# Altium project Nixie_clocks_Main_board.PrjPcb
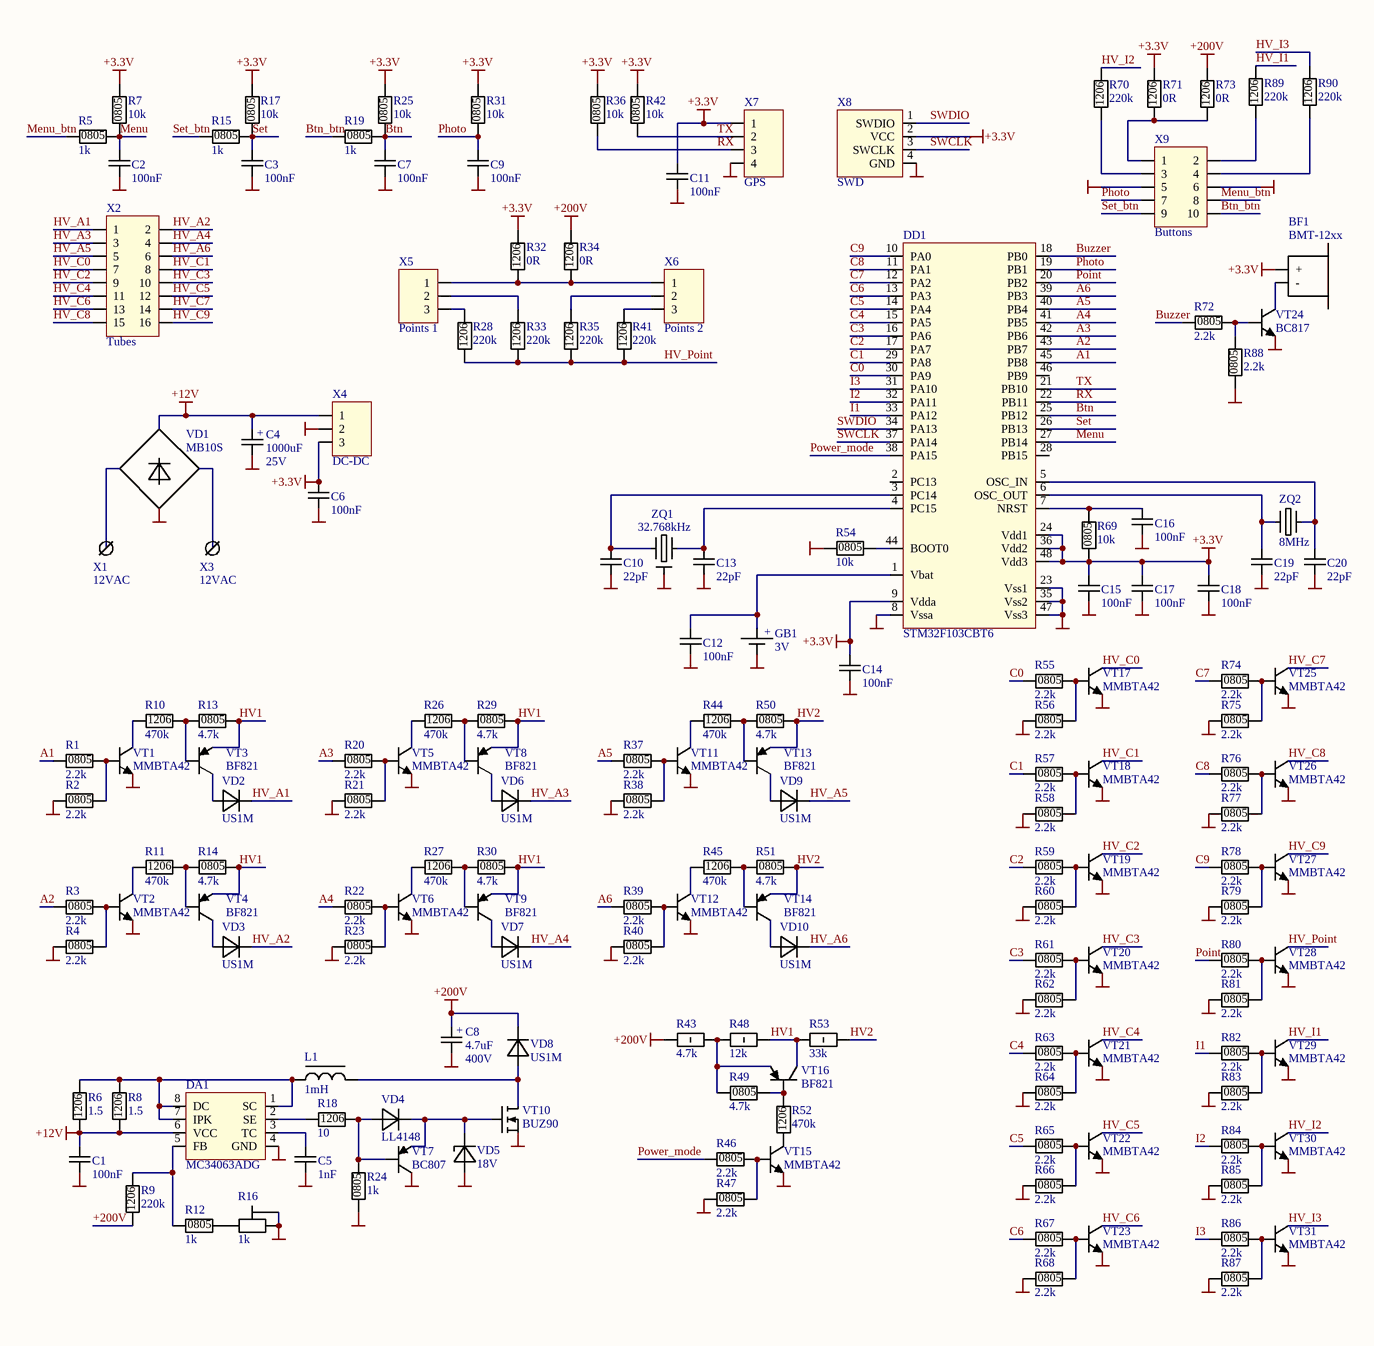
[diagram p0: Nixie_clocks_Main_board.SchDoc]
1 sheet, 167 parts. Net scope: global (net labels, ports and power ports of the same name join across sheets).
Board file: Nixie_clocks_Main_board.PcbDoc

## Sheet Nixie_clocks_Main_board.SchDoc
size A3 portrait

### Parts
BF1  BMT-12xx  [BMT-12xx]
C1  100nF  [C0805]
C2  100nF  [C0805]
C3  100nF  [C0805]
C4  1000uF  Voltage: 25V  [CapEl 10x20x5]
C5  1nF  [C0805]
C6  100nF  [C0805]
C7  100nF  [C0805]
C8  4.7uF  Voltage: 400V  [CapEl 10x20x5]
C9  100nF  [C0805]
C10  22pF  [C0805]
C11  100nF  [C0805]
C12  100nF  [C0805]
C13  22pF  [C0805]
C14  100nF  [C0805]
C15  100nF  [C0805]
C16  100nF  [C0805]
C17  100nF  [C0805]
C18  100nF  [C0805]
C19  22pF  [C0805]
C20  22pF  [C0805]
DA1  MC34063ADG  [SO8]
DD1  STM32F103CBT6  [LQFP48]
GB1  3V  [CH74-2032]
L1  1mH  [CESL inductor]
R1  2.2k  [R0805]
R2  2.2k  [R0805]
R3  2.2k  [R0805]
R4  2.2k  [R0805]
R5  1k  [R0805]
R6  1.5  [R1206]
R7  10k  [R0805]
R8  1.5  [R1206]
R9  220k  [R1206]
R10  470k  [R1206]
R11  470k  [R1206]
R12  1k  [R0805]
R13  4.7k  [R0805]
R14  4.7k  [R0805]
R15  1k  [R0805]
R16  1k  [3296W]
R17  10k  [R0805]
R18  10  [R1206]
R19  1k  [R0805]
R20  2.2k  [R0805]
R21  2.2k  [R0805]
R22  2.2k  [R0805]
R23  2.2k  [R0805]
R24  1k  [R0805]
R25  10k  [R0805]
R26  470k  [R1206]
R27  470k  [R1206]
R28  220k  [R1206]
R29  4.7k  [R0805]
R30  4.7k  [R0805]
R31  10k  [R0805]
R32  0R  [R1206]
R33  220k  [R1206]
R34  0R  [R1206]
R35  220k  [R1206]
R36  10k  [R0805]
R37  2.2k  [R0805]
R38  2.2k  [R0805]
R39  2.2k  [R0805]
R40  2.2k  [R0805]
R41  220k  [R1206]
R42  10k  [R0805]
R43  4.7k  [MF-1W Vertical]
R44  470k  [R1206]
R45  470k  [R1206]
R46  2.2k  [R0805]
R47  2.2k  [R0805]
R48  12k  [MF-1W Vertical]
R49  4.7k  [R0805]
R50  4.7k  [R0805]
R51  4.7k  [R0805]
R52  470k  [R1206]
R53  33k  [MF-1W Vertical]
R54  10k  [R0805]
R55  2.2k  [R0805]
R56  2.2k  [R0805]
R57  2.2k  [R0805]
R58  2.2k  [R0805]
R59  2.2k  [R0805]
R60  2.2k  [R0805]
R61  2.2k  [R0805]
R62  2.2k  [R0805]
R63  2.2k  [R0805]
R64  2.2k  [R0805]
R65  2.2k  [R0805]
R66  2.2k  [R0805]
R67  2.2k  [R0805]
R68  2.2k  [R0805]
R69  10k  [R0805]
R70  220k  [R1206]
R71  0R  [R1206]
R72  2.2k  [R0805]
R73  0R  [R1206]
R74  2.2k  [R0805]
R75  2.2k  [R0805]
R76  2.2k  [R0805]
R77  2.2k  [R0805]
R78  2.2k  [R0805]
R79  2.2k  [R0805]
R80  2.2k  [R0805]
R81  2.2k  [R0805]
R82  2.2k  [R0805]
R83  2.2k  [R0805]
R84  2.2k  [R0805]
R85  2.2k  [R0805]
R86  2.2k  [R0805]
R87  2.2k  [R0805]
R88  2.2k  [R0805]
R89  220k  [R1206]
R90  220k  [R1206]
VD1  MB10S  [MBS]
VD2  US1M  [SMA]
VD3  US1M  [SMA]
VD4  LL4148  [SOD80]
VD5  18V  [SOD80]
VD6  US1M  [SMA]
VD7  US1M  [SMA]
VD8  US1M  [SMA]
VD9  US1M  [SMA]
VD10  US1M  [SMA]
VT1  MMBTA42  [SOT23-3]
VT2  MMBTA42  [SOT23-3]
VT3  BF821  [SOT23-3]
VT4  BF821  [SOT23-3]
VT5  MMBTA42  [SOT23-3]
VT6  MMBTA42  [SOT23-3]
VT7  BC807  [SOT23-3]
VT8  BF821  [SOT23-3]
VT9  BF821  [SOT23-3]
VT10  BUZ90  [TO220-3]
VT11  MMBTA42  [SOT23-3]
VT12  MMBTA42  [SOT23-3]
VT13  BF821  [SOT23-3]
VT14  BF821  [SOT23-3]
VT15  MMBTA42  [SOT23-3]
VT16  BF821  [SOT23-3]
VT17  MMBTA42  [SOT23-3]
VT18  MMBTA42  [SOT23-3]
VT19  MMBTA42  [SOT23-3]
VT20  MMBTA42  [SOT23-3]
VT21  MMBTA42  [SOT23-3]
VT22  MMBTA42  [SOT23-3]
VT23  MMBTA42  [SOT23-3]
VT24  BC817  [SOT23-3]
VT25  MMBTA42  [SOT23-3]
VT26  MMBTA42  [SOT23-3]
VT27  MMBTA42  [SOT23-3]
VT28  MMBTA42  [SOT23-3]
VT29  MMBTA42  [SOT23-3]
VT30  MMBTA42  [SOT23-3]
VT31  MMBTA42  [SOT23-3]
X1  12VAC  [Terminal_2,8]
X2  Tubes  [IDC16]
X3  12VAC  [Terminal_2,8]
X4  DC-DC  [PBS3]
X5  Points 1  [WF-3]
X6  Points 2  [WF-3]
X7  GPS  [WF-4]
X8  SWD  [PLS4]
X9  Buttons  [IDC10]
ZQ1  32.768kHz  [DT-38]
ZQ2  8MHz  [HC49SM]

### Nets
+3.3V: BF1.1(+) C6.2 C11.2 C14.2 C15.2 C17.2 C18.2 DD1.9(Vdda) DD1.24(Vdd1) DD1.36(Vdd2) DD1.48(Vdd3) R7.2 R17.2 R25.2 R31.2 R32.2 R36.2 R42.2 R69.1 R71.2 X4.3 X7.1 X8.2(VCC)
+12V: C1.2 C4.1 DA1.6(VCC) R6.1 R8.1 VD1.1(+U) X4.1
+200V: C8.1 R9.1 R34.2 R43.1 R73.2 VD8.2(K)
GND: C1.1 C2.1 C3.1 C4.2 C5.1 C6.1 C7.1 C8.2 C9.1 C10.1 C11.1 C12.1 C13.1 C14.1 C15.1 C16.1 C17.1 C18.1 C19.1 C20.1 DA1.4(GND) DD1.8(Vssa) DD1.23(Vss1) DD1.35(Vss2) DD1.47(Vss3) GB1.2 R2.1 R4.1 R16.2 R16.3 R21.1 R23.1 R24.1 R38.1 R40.1 R47.1 R54.1 R56.1 R58.1 R60.1 R62.1 R64.1 R66.1 R68.1 R75.1 R77.1 R79.1 R81.1 R83.1 R85.1 R87.1 R88.1 VD1.4(-U) VD5.1(A) VT1.2(E) VT2.2(E) VT5.2(E) VT6.2(E) VT7.3(C) VT10.3(S) VT11.2(E) VT12.2(E) VT15.2(E) VT17.2(E) VT18.2(E) VT19.2(E) VT20.2(E) VT21.2(E) VT22.2(E) VT23.2(E) VT24.2(E) VT25.2(E) VT26.2(E) VT27.2(E) VT28.2(E) VT29.2(E) VT30.2(E) VT31.2(E) X4.2 X7.4 X8.4(GND) X9.5 X9.6 ZQ1.3
A1: DD1.45(PB8) R1.1
A2: DD1.43(PB7) R3.1
A3: DD1.42(PB6) R20.1
A4: DD1.41(PB5) R22.1
A5: DD1.40(PB4) R37.1
A6: DD1.39(PB3) R39.1
Btn: C7.2 DD1.25(PB12) R19.2 R25.1
Btn_btn: R19.1 X9.10
Buzzer: DD1.18(PB0) R72.1
C0: DD1.30(PA9) R55.1
C1: DD1.29(PA8) R57.1
C2: DD1.17(PA7) R59.1
C3: DD1.16(PA6) R61.1
C4: DD1.15(PA5) R63.1
C5: DD1.14(PA4) R65.1
C6: DD1.13(PA3) R67.1
C7: DD1.12(PA2) R74.1
C8: DD1.11(PA1) R76.1
C9: DD1.10(PA0) R78.1
HV1: R13.2 R14.2 R29.2 R30.2 R48.1 R53.1 VT3.2(E) VT4.2(E) VT8.2(E) VT9.2(E) VT16.3(C)
HV2: R50.2 R51.2 R53.2 VT13.2(E) VT14.2(E)
HV_A1: VD2.2(K) X2.1
HV_A2: VD3.2(K) X2.2
HV_A3: VD6.2(K) X2.3
HV_A4: VD7.2(K) X2.4
HV_A5: VD9.2(K) X2.5
HV_A6: VD10.2(K) X2.6
HV_C0: VT17.3(C) X2.7
HV_C1: VT18.3(C) X2.8
HV_C2: VT19.3(C) X2.9
HV_C3: VT20.3(C) X2.10
HV_C4: VT21.3(C) X2.11
HV_C5: VT22.3(C) X2.12
HV_C6: VT23.3(C) X2.13
HV_C7: VT25.3(C) X2.14
HV_C8: VT26.3(C) X2.15
HV_C9: VT27.3(C) X2.16
HV_I1: R89.2 VT29.3(C)
HV_I2: R70.2 VT30.3(C)
HV_I3: R90.2 VT31.3(C)
HV_Point: R28.1 R33.1 R35.1 R41.1 VT28.3(C)
I1: DD1.33(PA12) R82.1
I2: DD1.32(PA11) R84.1
I3: DD1.31(PA10) R86.1
Menu: C2.2 DD1.27(PB14) R5.2 R7.1
Menu_btn: R5.1 X9.8
Photo: C9.2 DD1.19(PB1) R31.1 X9.7
Point: DD1.20(PB2) R80.1
Power_mode: DD1.38(PA15) R46.1
RX: DD1.22(PB11) R36.1 X7.3
Set: C3.2 DD1.26(PB13) R15.2 R17.1
Set_btn: R15.1 X9.9
SWCLK: DD1.37(PA14) X8.3(SWCLK)
SWDIO: DD1.34(PA13) X8.1(SWDIO)
TX: DD1.21(PB10) R42.1 X7.2
NetBF1_2: BF1.2(-) VT24.3(C)
NetC5_2: C5.2 DA1.3(TC)
NetC10_2: C10.2 DD1.3(PC14) ZQ1.1
NetC12_2: C12.2 DD1.1(Vbat) GB1.1
NetC13_2: C13.2 DD1.4(PC15) ZQ1.2
NetC16_2: C16.2 DD1.7(NRST) R69.2
NetC19_2: C19.2 DD1.6(OSC_OUT) ZQ2.1
NetC20_2: C20.2 DD1.5(OSC_IN) ZQ2.2
NetDA1_1: DA1.1(SC) DA1.7(IPK) DA1.8(DC) L1.4 R6.2 R8.2
NetDA1_2: DA1.2(SE) R18.1
NetDA1_5: DA1.5(FB) R9.2 R12.1
NetDD1_44: DD1.44(BOOT0) R54.2
NetL1_1: L1.1 VD8.1(A) VT10.2(D)
NetR1_2: R1.2 R2.2 VT1.1(B)
NetR3_2: R3.2 R4.2 VT2.1(B)
NetR10_1: R10.1 VT1.3(C)
NetR10_2: R10.2 R13.1 VT3.1(B)
NetR11_1: R11.1 VT2.3(C)
NetR11_2: R11.2 R14.1 VT4.1(B)
NetR12_2: R12.2 R16.1
NetR18_2: R18.2 R24.2 VD4.1(A) VT7.1(B)
NetR20_2: R20.2 R21.2 VT5.1(B)
NetR22_2: R22.2 R23.2 VT6.1(B)
NetR26_1: R26.1 VT5.3(C)
NetR26_2: R26.2 R29.1 VT8.1(B)
NetR27_1: R27.1 VT6.3(C)
NetR27_2: R27.2 R30.1 VT9.1(B)
NetR28_2: R28.2 X5.3
NetR32_1: R32.1 R34.1 X5.1 X6.1
NetR33_2: R33.2 X5.2
NetR35_2: R35.2 X6.2
NetR37_2: R37.2 R38.2 VT11.1(B)
NetR39_2: R39.2 R40.2 VT12.1(B)
NetR41_2: R41.2 X6.3
NetR43_2: R43.2 R48.2 R49.1 VT16.2(E)
NetR44_1: R44.1 VT11.3(C)
NetR44_2: R44.2 R50.1 VT13.1(B)
NetR45_1: R45.1 VT12.3(C)
NetR45_2: R45.2 R51.1 VT14.1(B)
NetR46_2: R46.2 R47.2 VT15.1(B)
NetR49_2: R49.2 R52.2 VT16.1(B)
NetR52_1: R52.1 VT15.3(C)
NetR55_2: R55.2 R56.2 VT17.1(B)
NetR57_2: R57.2 R58.2 VT18.1(B)
NetR59_2: R59.2 R60.2 VT19.1(B)
NetR61_2: R61.2 R62.2 VT20.1(B)
NetR63_2: R63.2 R64.2 VT21.1(B)
NetR65_2: R65.2 R66.2 VT22.1(B)
NetR67_2: R67.2 R68.2 VT23.1(B)
NetR70_1: R70.1 X9.3
NetR71_1: R71.1 R73.1 X9.1
NetR72_2: R72.2 R88.2 VT24.1(B)
NetR74_2: R74.2 R75.2 VT25.1(B)
NetR76_2: R76.2 R77.2 VT26.1(B)
NetR78_2: R78.2 R79.2 VT27.1(B)
NetR80_2: R80.2 R81.2 VT28.1(B)
NetR82_2: R82.2 R83.2 VT29.1(B)
NetR84_2: R84.2 R85.2 VT30.1(B)
NetR86_2: R86.2 R87.2 VT31.1(B)
NetR89_1: R89.1 X9.2
NetR90_1: R90.1 X9.4
NetVD1_2: VD1.2(AC1) X1.1
NetVD1_3: VD1.3(AC2) X3.1
NetVD2_1: VD2.1(A) VT3.3(C)
NetVD3_1: VD3.1(A) VT4.3(C)
NetVD4_2: VD4.2(K) VD5.2(K) VT7.2(E) VT10.1(G)
NetVD6_1: VD6.1(A) VT8.3(C)
NetVD7_1: VD7.1(A) VT9.3(C)
NetVD9_1: VD9.1(A) VT13.3(C)
NetVD10_1: VD10.1(A) VT14.3(C)

Not connected (* = marked no-connect by the designer): DD1 2(PC13) 28(PB15) 46(PB9)

### Notes on the sheet
- (in symbol CapEL_10x20x5) +
- (in symbol CH74-2032) +
- (in symbol R0805) 0805
- (in symbol R1206) 1206

### Library data of the parts
BF1 = BMT-12xx: Magnetic transducer; Part Number: BMT-12xx
C1-C3 C5-C7 C9-C20 = C0805: 0805 SMD capacitors; Part Number: C0805
C4 C8 = CapEL_10x20x5: Electrolytic capacitor; Part Number: CapEL_10x20x5
DA1 = MC34063ADG: 1.5A, Step-Up/Down/Inverting Switching Regulator; Part Number: MC34063ADG
DD1 = STM32F103CBT6: ARM Cortex-M3 MCU with 128kB Flash, USB, CAN, etc.; Part Number: STM32F103CBT6
GB1 = CH74-2032: Lithium CR2032 Vertical THT Battery Holder; Part Number: CH74-2032
L1 = CESL inductor 1: Compact energy-saving lamp inductor; Part Number: CESL inductor 1
R1-R5 R7 R12-R15 R17 R19-R25 R29-R31 R36-R40 R42 R46 R47 R49-R51 R54-R69 R72 R74-R88 = R0805: 0805 SMD 1/8W resistor; Part Number: R0805
R6 R8-R11 R18 R26-R28 R32-R35 R41 R44 R45 R52 R70 R71 R73 R89 R90 = R1206: 1206 SMD 1/4W resistor; Part Number: R1206
R16 = 3296W: Multiturn Trimmer Resistor; Part Number: 3296W
R43 R48 R53 = MF-1WV: 1W THT Resistor (Vertical mounting); Part Number: MF-1WV
VD1 = MB10S: Single-Phase Silicon Bridge Rectifier; Part Number: MB10S
VD2 VD3 VD6-VD10 = US1M: Surface Mount Ultrafast Rectifier; Part Number: US1M
VD4 = LL4148: 75V 150mA Small Signal Fast Switching Diode; Part Number: LL4148
VD5 = BZV55: 500mW SMD Zener Diode; Part Number: BZV55
VT1 VT2 VT5 VT6 VT11 VT12 VT15 VT17-VT23 VT25-VT31 = MMBTA42: 300V 500mA SOT23-3 SMD NPN transistor with h21>25; Part Number: MMBTA42
VT3 VT4 VT8 VT9 VT13 VT14 VT16 = BF821: 300V 50mA SOT23-3 SMD PNP transistor with h21>50; Part Number: BF821
VT7 = BC807: 45V 500mA SOT23-3 SMD PNP transistor with h21>100; Part Number: BC807
VT10 = BUZ90: 600V 4.5A TO220-3 THT n-MOSFET transistor; Part Number: BUZ90
VT24 = BC817: 45V 500mA SOT23-3 SMD NPN transistor with h21>100; Part Number: BC817
X1 X3 = Term_2.8: Terminal; Part Number: Term_2.8
X2 = IDC-16: PCB Connector; Part Number: IDC-16
X4 = PBS-3: PCB Connector; Part Number: PBS-3
X5 X6 = WF-3: PCB Connector; Part Number: WF-3
X7 = WF-4: PCB Connector; Part Number: WF-4
X8 = SWD: 4 pin SWD connector for ARM MCU programming; Part Number: SWD
X9 = IDC-10: PCB Connector; Part Number: IDC-10
ZQ1 = DT-38: RTC THT Quartz Resonator; Part Number: DT-38
ZQ2 = HC49SM: Standard SMD Quartz Resonator; Part Number: HC49SM